# Altium schematic sheet Schematics.SchDoc
size B; Date: 10/29/2020; CheckedBy: Patrick Carberry; DrawnBy: Jaekyung Song; Engineer: Jaekyung Song; Organization: KVH Industries, Inc.; Address1: 50 Enterprise Center; Address2: Middletown, RI; Address3: 02842; Address4: USA; Revision: 1; SheetNumber: 1; SheetTotal: 1; PageSetup: Record=PageOptions|CenterHorizontal=True|CenterVertical=True|PrintScale=0.33|XCorrection=1.00|YCorrection=1.00|PrintKind=1|BorderSize=5000000|LeftOffset=0|BottomOffset=0|Orientation=2|PaperLength=1000|PaperWidth=1000|Scale=100|PaperSource=15|PrintQuality=600|MediaType=1|DitherType=10|PaperKind=Letter|PrintScaleMode=1; DrawnByDate: 10/29/2020; CheckedByDate: 12/8/2020; ContractNumber: i14707; CageCode: 72197; SheetSize: D; Scale: NONE
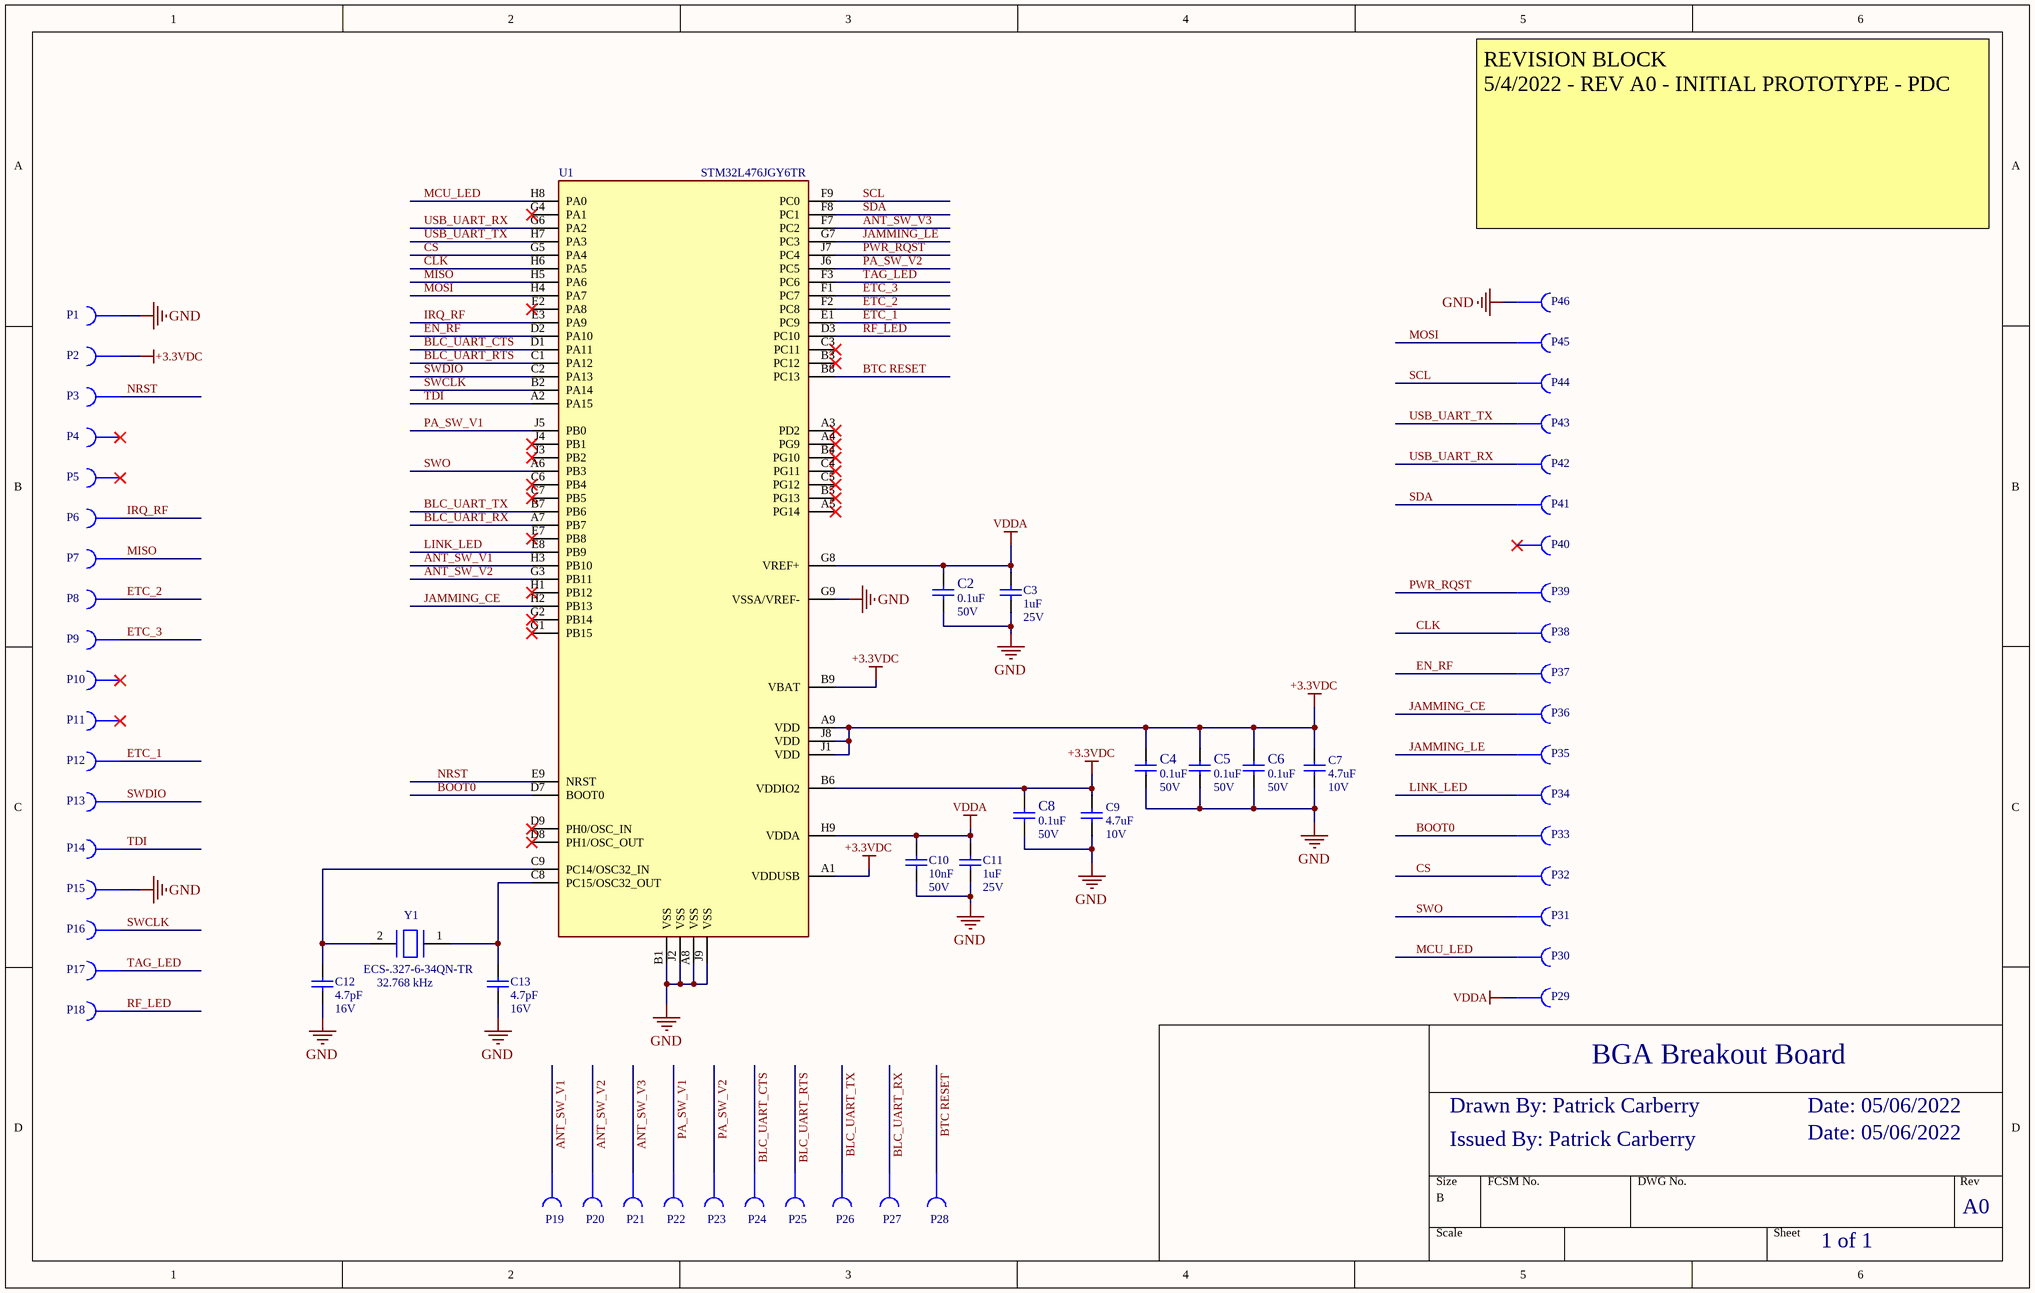
[diagram p0: Schematics.SchDoc]

## Parts
C2  value 0.1uF  Voltage Rating: 50V  [CAP_0402_0.55MM]  (hidden comment: GRM155R71H104KE14J)
C3  value 1uF  Voltage Rating: 25V  [CAP_0402_0.55MM]  (hidden comment: GRM155R61E105MA12D)
C4  value 0.1uF  Voltage Rating: 50V  [CAP_0402_0.55MM]  (hidden comment: GRM155R71H104KE14J)
C5  value 0.1uF  Voltage Rating: 50V  [CAP_0402_0.55MM]  (hidden comment: GRM155R71H104KE14J)
C6  value 0.1uF  Voltage Rating: 50V  [CAP_0402_0.55MM]  (hidden comment: GRM155R71H104KE14J)
C7  value 4.7uF  Voltage Rating: 10V  [CAP_0402_0.55MM]  (hidden comment: CL05A475KP5NRNC)
C8  value 0.1uF  Voltage Rating: 50V  [CAP_0402_0.55MM]  (hidden comment: GRM155R71H104KE14J)
C9  value 4.7uF  Voltage Rating: 10V  [CAP_0402_0.55MM]  (hidden comment: CL05A475KP5NRNC)
C10  value 10nF  Voltage Rating: 50V  [CAP_0402_0.55MM]  (hidden comment: GCM155R71H103KA55J)
C11  value 1uF  Voltage Rating: 25V  [CAP_0402_0.55MM]  (hidden comment: GRM155R61E105MA12D)
C12  value 4.7pF  Voltage Rating: 16V  [CAP_0402_0.55MM]  (hidden comment: 885012005023)
C13  value 4.7pF  Voltage Rating: 16V  [CAP_0402_0.55MM]  (hidden comment: 885012005023)
P1  1-PIN-HDR-GEN  [1X01-PIN]  (value not drawn)
P2  1-PIN-HDR-GEN  [1X01-PIN]  (value not drawn)
P3  1-PIN-HDR-GEN  [1X01-PIN]  (value not drawn)
P4  1-PIN-HDR-GEN  [1X01-PIN]  (value not drawn)
P5  1-PIN-HDR-GEN  [1X01-PIN]  (value not drawn)
P6  1-PIN-HDR-GEN  [1X01-PIN]  (value not drawn)
P7  1-PIN-HDR-GEN  [1X01-PIN]  (value not drawn)
P8  1-PIN-HDR-GEN  [1X01-PIN]  (value not drawn)
P9  1-PIN-HDR-GEN  [1X01-PIN]  (value not drawn)
P10  1-PIN-HDR-GEN  [1X01-PIN]  (value not drawn)
P11  1-PIN-HDR-GEN  [1X01-PIN]  (value not drawn)
P12  1-PIN-HDR-GEN  [1X01-PIN]  (value not drawn)
P13  1-PIN-HDR-GEN  [1X01-PIN]  (value not drawn)
P14  1-PIN-HDR-GEN  [1X01-PIN]  (value not drawn)
P15  1-PIN-HDR-GEN  [1X01-PIN]  (value not drawn)
P16  1-PIN-HDR-GEN  [1X01-PIN]  (value not drawn)
P17  1-PIN-HDR-GEN  [1X01-PIN]  (value not drawn)
P18  1-PIN-HDR-GEN  [1X01-PIN]  (value not drawn)
P19  1-PIN-HDR-GEN  [1X01-PIN]  (value not drawn)
P20  1-PIN-HDR-GEN  [1X01-PIN]  (value not drawn)
P21  1-PIN-HDR-GEN  [1X01-PIN]  (value not drawn)
P22  1-PIN-HDR-GEN  [1X01-PIN]  (value not drawn)
P23  1-PIN-HDR-GEN  [1X01-PIN]  (value not drawn)
P24  1-PIN-HDR-GEN  [1X01-PIN]  (value not drawn)
P25  1-PIN-HDR-GEN  [1X01-PIN]  (value not drawn)
P26  1-PIN-HDR-GEN  [1X01-PIN]  (value not drawn)
P27  1-PIN-HDR-GEN  [1X01-PIN]  (value not drawn)
P28  1-PIN-HDR-GEN  [1X01-PIN]  (value not drawn)
P29  1-PIN-HDR-GEN  [1X01-PIN]  (value not drawn)
P30  1-PIN-HDR-GEN  [1X01-PIN]  (value not drawn)
P31  1-PIN-HDR-GEN  [1X01-PIN]  (value not drawn)
P32  1-PIN-HDR-GEN  [1X01-PIN]  (value not drawn)
P33  1-PIN-HDR-GEN  [1X01-PIN]  (value not drawn)
P34  1-PIN-HDR-GEN  [1X01-PIN]  (value not drawn)
P35  1-PIN-HDR-GEN  [1X01-PIN]  (value not drawn)
P36  1-PIN-HDR-GEN  [1X01-PIN]  (value not drawn)
P37  1-PIN-HDR-GEN  [1X01-PIN]  (value not drawn)
P38  1-PIN-HDR-GEN  [1X01-PIN]  (value not drawn)
P39  1-PIN-HDR-GEN  [1X01-PIN]  (value not drawn)
P40  1-PIN-HDR-GEN  [1X01-PIN]  (value not drawn)
P41  1-PIN-HDR-GEN  [1X01-PIN]  (value not drawn)
P42  1-PIN-HDR-GEN  [1X01-PIN]  (value not drawn)
P43  1-PIN-HDR-GEN  [1X01-PIN]  (value not drawn)
P44  1-PIN-HDR-GEN  [1X01-PIN]  (value not drawn)
P45  1-PIN-HDR-GEN  [1X01-PIN]  (value not drawn)
P46  1-PIN-HDR-GEN  [1X01-PIN]  (value not drawn)
U1  STM32L476JGY6TR  [BGA72C40P9X9_441X374X56]
Y1  ECS-.327-6-34QN-TR  value 32.768 kHz  [CRY_3.2X1.5_2SMD]

## Nets
+3.3VDC: C4.2 C5.2 C6.2 C7.1 C8.2 C9.1 P2.1(P$1) U1.A1(VDDUSB) U1.A9(VDD) U1.B6(VDDIO2) U1.B9(VBAT) U1.J1(VDD) U1.J8(VDD)
GND: C2.1 C3.2 C4.1 C5.1 C6.1 C7.2 C8.1 C9.2 C10.2 C11.2 C12.2 C13.2 P1.1(P$1) P15.1(P$1) P46.1(P$1) U1.A8(VSS) U1.B1(VSS) U1.G9(VSSA/VREF-) U1.J2(VSS) U1.J9(VSS)
VDDA: C2.2 C3.1 C10.1 C11.1 P29.1(P$1) U1.G8(VREF+) U1.H9(VDDA)
ANT_SW_V1: P19.1(P$1) U1.H3(PB10)
ANT_SW_V2: P20.1(P$1) U1.G3(PB11)
ANT_SW_V3: P21.1(P$1) U1.F7(PC2)
BLC_UART_CTS: P24.1(P$1) U1.D1(PA11)
BLC_UART_RTS: P25.1(P$1) U1.C1(PA12)
BLC_UART_RX: P27.1(P$1) U1.A7(PB7)
BLC_UART_TX: P26.1(P$1) U1.B7(PB6)
BOOT0: P33.1(P$1) U1.D7(BOOT0)
BTC RESET: P28.1(P$1) U1.B8(PC13)
CLK: P38.1(P$1) U1.H6(PA5)
CS: P32.1(P$1) U1.G5(PA4)
EN_RF: P37.1(P$1) U1.D2(PA10)
ETC_1: P12.1(P$1) U1.E1(PC9)
ETC_2: P8.1(P$1) U1.F2(PC8)
ETC_3: P9.1(P$1) U1.F1(PC7)
IRQ_RF: P6.1(P$1) U1.E3(PA9)
JAMMING_CE: P36.1(P$1) U1.H2(PB13)
JAMMING_LE: P35.1(P$1) U1.G7(PC3)
LINK_LED: P34.1(P$1) U1.E8(PB9)
MCU_LED: P30.1(P$1) U1.H8(PA0)
MISO: P7.1(P$1) U1.H5(PA6)
MOSI: P45.1(P$1) U1.H4(PA7)
NRST: P3.1(P$1) U1.E9(NRST)
PA_SW_V1: P22.1(P$1) U1.J5(PB0)
PA_SW_V2: P23.1(P$1) U1.J6(PC5)
PWR_RQST: P39.1(P$1) U1.J7(PC4)
RF_LED: P18.1(P$1) U1.D3(PC10)
SCL: P44.1(P$1) U1.F9(PC0)
SDA: P41.1(P$1) U1.F8(PC1)
SWCLK: P16.1(P$1) U1.B2(PA14)
SWDIO: P13.1(P$1) U1.C2(PA13)
SWO: P31.1(P$1) U1.A6(PB3)
TAG_LED: P17.1(P$1) U1.F3(PC6)
TDI: P14.1(P$1) U1.A2(PA15)
USB_UART_RX: P42.1(P$1) U1.G6(PA2)
USB_UART_TX: P43.1(P$1) U1.H7(PA3)
NetC12_1: C12.1 U1.C9(PC14/OSC32_IN) Y1.2(X2)
NetC13_1: C13.1 U1.C8(PC15/OSC32_OUT) Y1.1(X1)

Not connected (* = marked no-connect by the designer): P4 1(P$1)*; P5 1(P$1)*; P10 1(P$1)*; P11 1(P$1)*; P40 1(P$1)*; U1 A3(PD2)* A4(PG9)* A5(PG14)* B3(PC12)* B4(PG10)* B5(PG13)* C3(PC11)* C4(PG11)* C5(PG12)* C6(PB4)* C7(PB5)* D8(PH1/OSC_OUT)* D9(PH0/OSC_IN)* E2(PA8)* E7(PB8)* G1(PB15)* G2(PB14)* G4(PA1)* H1(PB12)* J3(PB2)* J4(PB1)*

## Notes on the sheet
- REVISION BLOCK
  5/4/2022 - REV A0 - INITIAL PROTOTYPE - PDC
- BGA Breakout Board
- Drawn By: Patrick Carberry
- Issued By: Patrick Carberry
- Date: 05/06/2022
- A0
- 1 of 1
- REVISION
- ZONE
- LTR
- DESCRIPTION
- DATE
- APPROVED
- CONTRACT NO:
- DRAWN:
- APPROVALS
- CHECKED:
- SIZE:
- CAGE CODE
- DRAWING NO.
- REV:
- ISSUED:
- SCALE:
- SHEET
- OF

## Library data of the parts
C2 C4-C6 C8 = CAP_0.1UF_50V_20%_0402: Manufacturer: Murata; Height: 0.55MM; Manufacturer Part Number: GRM155R71H104KE14J; ComponentLink1Description: Datasheet; ComponentLink1URL: https://search.murata.co.jp/Ceramy/image/img/A01X/G101/ENG/GRM155R71E104ME14-01.pdf
C3 C11 = CAP_1UF_25V_20%_0402: Manufacturer: Murata; Height: 0.55MM; Manufacturer Part Number: GRM155R61E105MA12D; Package: 0402
C7 C9 = CAP_4.7UF_10V_X5R_0402: CAP CER 4.7UF 10V X5R 0402; Manufacturer: Samsung Electro-Mechanics; Manufacturer Part Number: CL05A475KP5NRNC; ComponentLink1Description: Datasheet; ComponentLink1URL: https://media.digikey.com/pdf/Data%20Sheets/Samsung%20PDFs/CL05A475KP5NRNC_Spec.pdf
C10 = CAP_10NF_50V_10%_0402: Manufacturer: Murata; Height: 0.55MM; Manufacturer Part Number: GCM155R71H103KA55J; Package: 0402; ComponentLink1Description: Datasheet; ComponentLink1URL: https://search.murata.co.jp/Ceramy/image/img/A01X/G101/ENG/GCM155R71H103KA55-01.pdf
C12 C13 = CAP_4.7PF_16V_C0G_0402: Manufacturer: Würth Elektronik; Manufacturer Part Number: 885012005023; ComponentLink1Description: Datasheet; ComponentLink1URL: https://www.we-online.com/katalog/datasheet/885012005023.pdf
P1-P46 = 1-PIN-HDR-GEN: Generic through hole; Manufacturer Part Number: DNP; Manufacturer: N/A
U1 = MCU_ARM_CM4_80MHZ_STM32L476JGY6TR: ARM Microcontrollers - MCU Ultra-low-power FPU Arm Cortex-M4 MCU 80 MHz 1 Mbyte of Flash LCD, USB OTG, DFSD; Manufacturer: STMicroelectronics; Manufacturer Part Number: STM32L476JGY6TR; ComponentLink1Description: Datasheet; ComponentLink1URL: https://www.st.com/content/ccc/resource/technical/document/datasheet/c5/ed/2f/60/aa/79/42/0b/DM00108832.pdf/files/DM00108832.pdf/jcr:content/translations/en.DM00108832.pdf
Y1 = CRY_32.768KHZ_70K_4PF_2SMD: 32.768 kHz ±20ppm Crystal 6pF 70 kOhms 2-SMD, No Lead; Manufacturer: ECS; Height: 0.9mm; Manufacturer Part Number: ECS-.327-6-34QN-TR; ComponentLink1Description: Datasheet; ComponentLink1URL: https://www.mouser.de/ProductDetail/ECS/ECS-327-6-34QN-TR/?qs=%2FnKYMpMO73Pux8utSILL9w%3D%3D